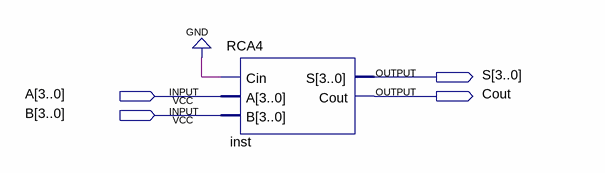
[diagram p0: schematic sheet]
// Quartus schematic RCA4bits.bdf as structural Verilog: 1 symbols, 4 pins
module RCA4bits (
  input  [3:0] A,
  input  [3:0] B,
  output [3:0] S,
  output Cout
);

  RCA4 inst (.Cin(1'b0), .A(A), .B(B), .S(S), .Cout(Cout));
endmodule
